# EAGLE design Kube-Module-ADIO (EAGLE 9.6.2)
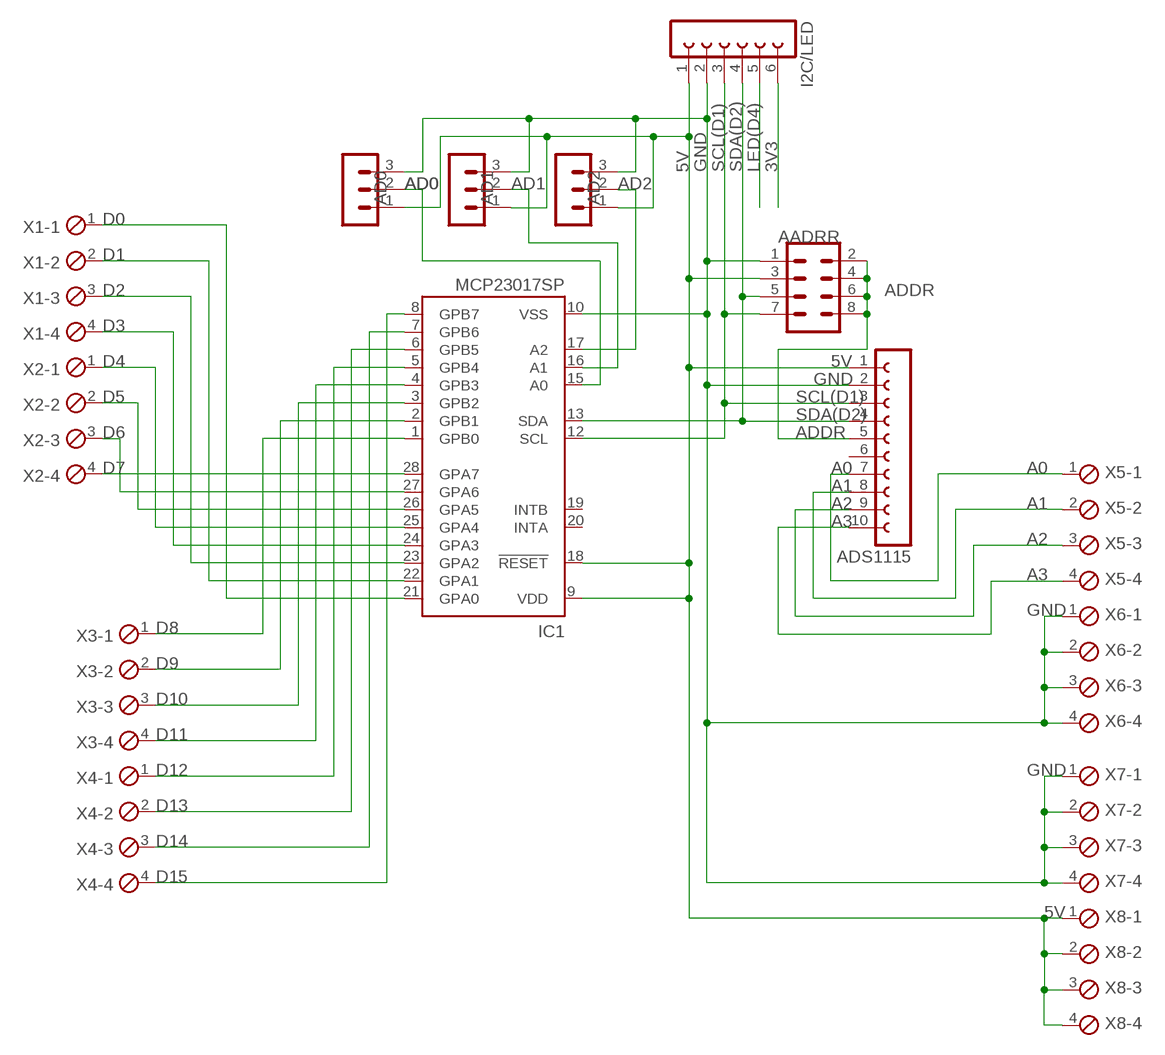
[diagram p0: schematic, sheet 1]

## Parts
AADRR  MA04-2  [MA04-2]
AD0  MA03-1  [MA03-1]
AD1  MA03-1  [MA03-1]
AD2  MA03-1  [MA03-1]
ADS1115  FE10W  [FE10W]
I2C/LED  FE06-1  [FE06]
IC1  MCP23017SP  [DIL28-3]
X1  MPT4  [4POL254]
X2  MPT4  [4POL254]
X3  MPT4  [4POL254]
X4  MPT4  [4POL254]
X5  MPT4  [4POL254]
X6  MPT4  [4POL254]
X7  MPT4  [4POL254]
X8  MPT4  [4POL254]

## Nets
3V3: I2C/LED.6
5V: AADRR.3 AD0.1 AD1.1 AD2.1 ADS1115.1 I2C/LED.1 IC1.9(VDD) IC1.18(!RESET) X8.1 X8.2 X8.3 X8.4
A0: ADS1115.7 X5.1
A1: ADS1115.8 X5.2
A2: ADS1115.9 X5.3
A3: ADS1115.10 X5.4
AD0: AD0.2 IC1.15(A0)
AD1: AD1.2 IC1.16(A1)
AD2: AD2.2 IC1.17(A2)
ADDR: AADRR.2 AADRR.4 AADRR.6 AADRR.8 ADS1115.5
D0: IC1.21(GPA0) X1.1
D1: IC1.22(GPA1) X1.2
D2: IC1.23(GPA2) X1.3
D3: IC1.24(GPA3) X1.4
D4: IC1.25(GPA4) X2.1
D5: IC1.26(GPA5) X2.2
D6: IC1.27(GPA6) X2.3
D7: IC1.28(GPA7) X2.4
D8: IC1.1(GPB0) X3.1
D9: IC1.2(GPB1) X3.2
D10: IC1.3(GPB2) X3.3
D11: IC1.4(GPB3) X3.4
D12: IC1.5(GPB4) X4.1
D13: IC1.6(GPB5) X4.2
D14: IC1.7(GPB6) X4.3
D15: IC1.8(GPB7) X4.4
GND: AADRR.1 AD0.3 AD1.3 AD2.3 ADS1115.2 I2C/LED.2 IC1.10(VSS) X6.1 X6.2 X6.3 X6.4 X7.1 X7.2 X7.3 X7.4
LED(D4): I2C/LED.5
SCL(D1): AADRR.7 ADS1115.3 I2C/LED.3 IC1.12(SCL)
SDA(D2): AADRR.5 ADS1115.4 I2C/LED.4 IC1.13(SDA)
Unconnected: ADS1115.6 IC1.19(INTB) IC1.20(INTA)

## Library data of the parts
AADRR = con-lstb:MA04-2: PIN HEADER; OC_FARNELL: unknown; OC_NEWARK: unknown
AD0 AD1 AD2 = con-lstb:MA03-1: PIN HEADER; OC_FARNELL: unknown; OC_NEWARK: unknown
ADS1115 = con-lsta:FE10W: FEMALE HEADER; OC_FARNELL: unknown; OC_NEWARK: unknown
I2C/LED = con-lsta:FE06-1: FEMALE HEADER; OC_FARNELL: unknown; OC_NEWARK: unknown
IC1 = adafruit:MCP23017: http://ww1.microchip.com/downloads/en/DeviceDoc/21952a.pdf Source: http://ww1.microchip.com/downloads/en/DeviceDoc/21952a.pdf
X1-X8 = con-phoenix-254:MPT4: PHOENIX CONNECTOR; OC_FARNELL: unknown; OC_NEWARK: unknown

## Board
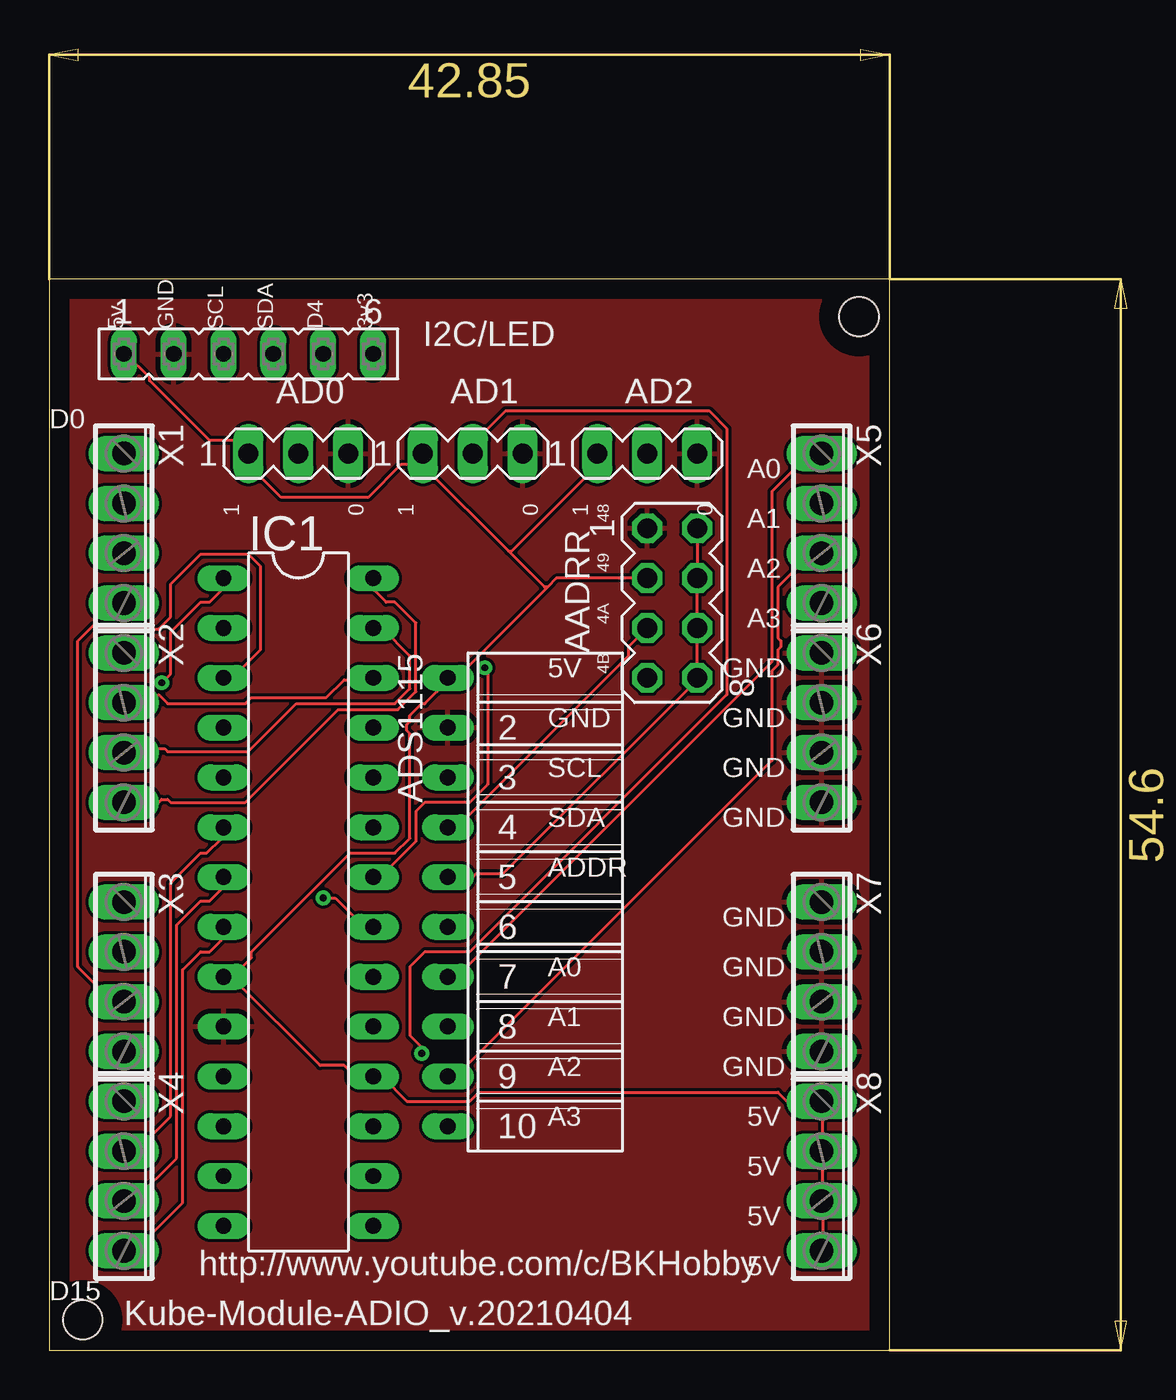
[diagram p1: board, top side]
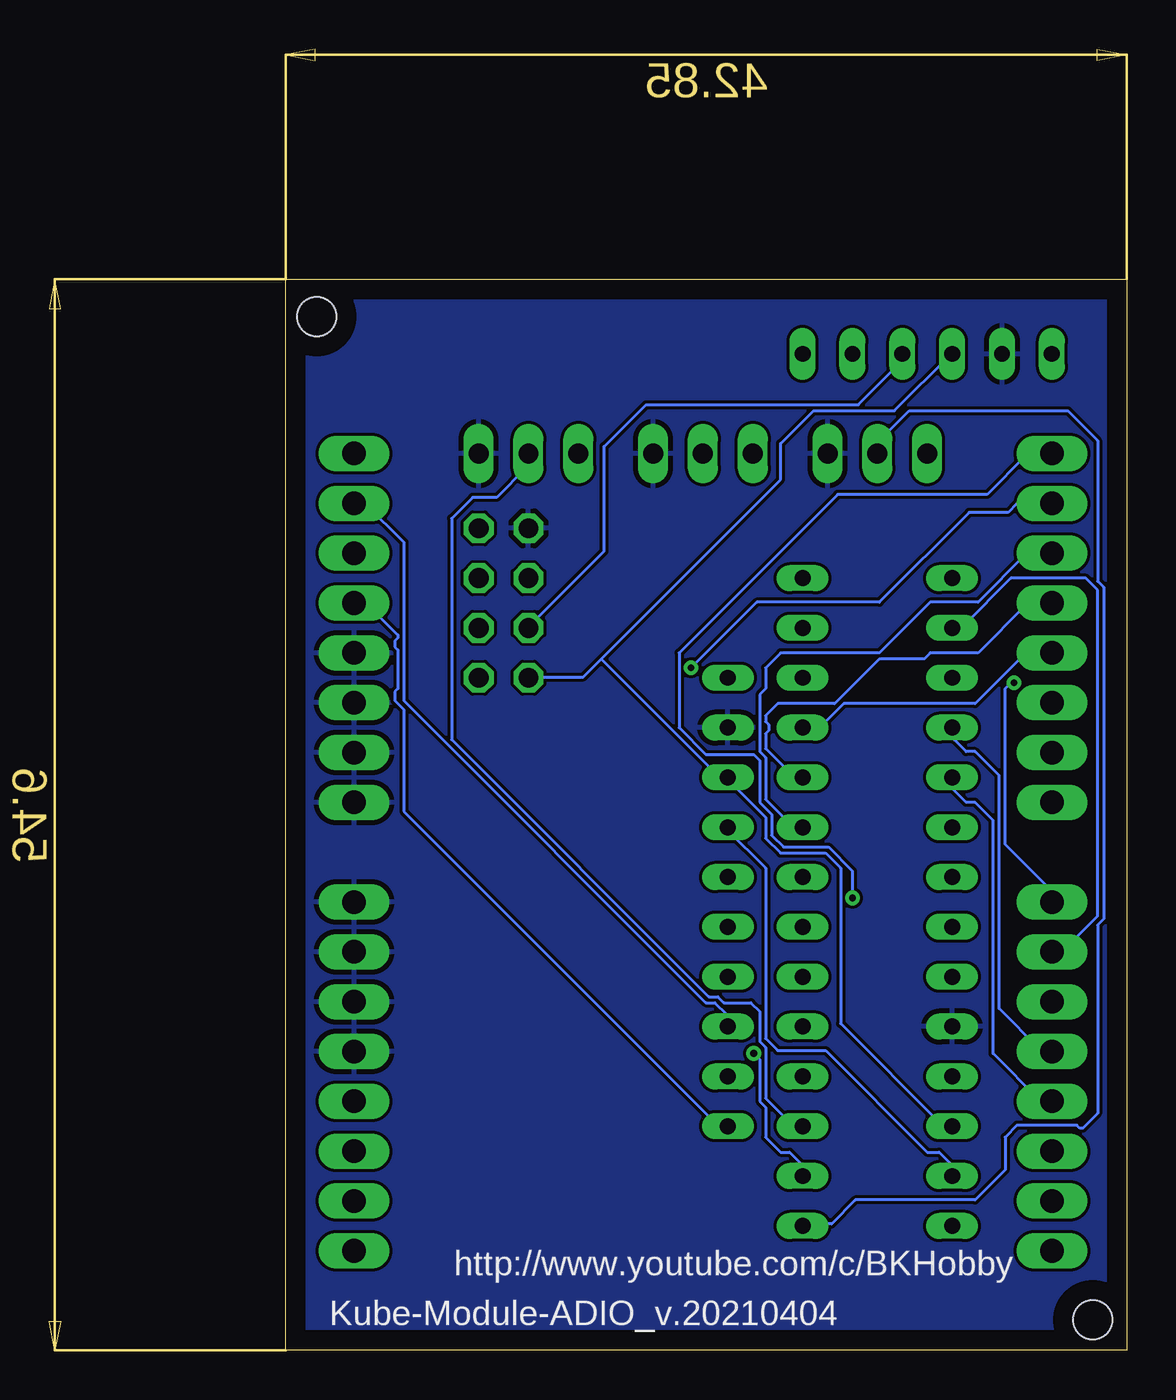
[diagram p2: board, bottom side, seen from below]

Size 42.85 x 54.6 mm. Coordinates in mm from the lower left corner, seen from the top.
Outline: 0,0 42.85,0 42.85,54.6 0,54.6 0,0
Copper layers (1*16): Top 0.035mm / dielectric 1.5mm / Bottom 0.035mm
Design rules "default": minimum track width 6mil, minimum drill 0.35mm, track to track 6mil, track to pad 6mil, pad to pad 6mil, via to via 6mil, smd to smd 6mil, copper to edge 40mil, drill to drill 6mil, minimum pad ring 10mil, minimum via ring 8mil, stop-mask expansion 4mil, vias tented up to drill 0mil, thermal gap 10mil
Holes 2 mm at 41.27,52.7 1.72,1.56

### Footprints (pad centres in the part's own frame; a part is rotated, then mirrored left to right if it is on the bottom)
MA04-2 = drill 1.016 octagon: 1 -3.81,-1.27; 2 -3.81,1.27; 3 -1.27,-1.27; 4 -1.27,1.27; 5 1.27,-1.27; 6 1.27,1.27; 7 3.81,-1.27; 8 3.81,1.27
MA03-1 = drill 1.016 long: 1 -2.54,0; 2 0,0; 3 2.54,0
FE10W = drill 0.813 long: 1 -11.43,0; 2 -8.89,0; 3 -6.35,0; 4 -3.81,0; 5 -1.27,0; 6 1.27,0; 7 3.81,0; 8 6.35,0; 9 8.89,0; 10 11.43,0
FE06 = drill 0.813 long: 1 -6.35,0; 2 -3.81,0; 3 -1.27,0; 4 1.27,0; 5 3.81,0; 6 6.35,0
DIL28-3 = drill 0.813 long: 1 -16.51,-3.81; 2 -13.97,-3.81; 3 -11.43,-3.81; 4 -8.89,-3.81; 5 -6.35,-3.81; 6 -3.81,-3.81; 7 -1.27,-3.81; 8 1.27,-3.81; 9 3.81,-3.81; 10 6.35,-3.81; 11 8.89,-3.81; 12 11.43,-3.81; 13 13.97,-3.81; 14 16.51,-3.81; 15 16.51,3.81; 16 13.97,3.81; 17 11.43,3.81; 18 8.89,3.81; 19 6.35,3.81; 20 3.81,3.81; 21 1.27,3.81; 22 -1.27,3.81; 23 -3.81,3.81; 24 -6.35,3.81; 25 -8.89,3.81; 26 -11.43,3.81; 27 -13.97,3.81; 28 -16.51,3.81
4POL254 = drill 1.2 long: 1 -3.81,0; 2 -1.27,0; 3 1.27,0; 4 3.81,0

### Placement (x,y rotation side)
AADRR  31.75,38.1 270 top
AD0  12.7,45.72 0 top
AD1  21.59,45.72 0 top
AD2  30.48,45.72 0 top
ADS1115  20.32,22.86 270 top
I2C/LED  10.16,50.8 0 top
IC1  12.7,22.86 270 top
X1  3.81,41.91 270 top
X2  3.81,31.75 270 top
X3  3.81,19.05 270 top
X4  3.81,8.89 270 top
X5  39.37,41.91 270 top
X6  39.37,31.75 270 top
X7  39.37,19.05 270 top
X8  39.37,8.89 270 top

### Tracks (layer width: path | path; a pad name or v marks a point on that pad's centre or on a via)
5V
  Top 0.152: I2C/LED.1 3.91,50.8 5.13,49.58 5.13,49.43 8.18,46.38 9.55,46.38 10.16,45.77 AD0.1 10.16,45.16 11.84,43.48 16.26,43.48 17.93,45.16 19.15,45.16 | 25.4,38.91 25.86,39.37 AADRR.3 | 25.4,38.91 20.83,34.34 20.37,34.34 ADS1115.1 19.76,33.73 19.76,33.58 19.15,32.97 19,32.97 18.39,32.36 18.39,32.06 18.24,31.9 18.24,31.6 18.39,31.44 18.39,26.11 17.63,25.35 15.34,25.35 10.31,20.32 10.31,20.02 9.25,18.95 | 19.15,45.16 19.15,45.01 23.42,40.74 | 19.15,45.16 19.15,45.62 AD1.1 19.15,45.16 | 23.42,40.74 25.25,38.91 25.4,38.91 | 23.42,40.74 23.57,40.74 27.84,45.01 27.84,45.62 AD2.1 | X8.4 39.42,5.08 39.42,7.52 X8.3 39.42,7.67 39.42,10.11 X8.2 39.42,10.26 39.42,12.7 X8.1 37.59,12.7 37.14,13.16 21.89,13.16 21.44,12.7 18.24,12.7 17.02,13.92 16.56,13.92 IC1.18 16.41,14.07 15.49,14.07 15.04,14.53 13.82,14.53 9.4,18.95 9.25,18.95 | 9.25,18.95 8.94,18.95 IC1.9 9.25,18.95
A0
  Top 0.152: ADS1115.7 20.37,19.1 20.83,19.1 36.83,35.1 36.83,43.79 38.66,45.62 39.27,45.62 X5.1
A1
  Bottom 0.152: X5.2 38.81,43.18 36.83,41.2 36.83,33.12 21.44,17.73 20.98,17.73 20.37,17.12 20.37,16.51 ADS1115.8
A2
  Top 0.152: ADS1115.9 20.37,14.07 20.83,14.07 36.83,30.07 36.83,34.65 37.14,34.95 37.14,35.71 37.29,35.86 37.29,36.17 37.14,36.32 37.14,38.91 38.81,40.59 39.27,40.59 X5.3
A3
  Bottom 0.152: ADS1115.10 20.37,11.48 20.83,11.48 36.83,27.48 36.83,32.66 37.29,33.12 37.29,33.58 37.14,33.73 37.14,35.71 37.29,35.86 37.29,36.17 37.14,36.32 37.14,36.47 38.66,38 39.27,38 X5.4
AD0
  Bottom 0.152: IC1.15 16.41,6.45 15.04,6.45 13.82,7.67 7.72,7.67 6.2,9.2 6.2,10.87 5.59,11.48 2.54,11.48 2.39,11.33 2.23,11.33 1.47,12.09 1.47,21.69 1.17,22 1.17,38.91 1.47,39.22 1.47,46.38 3,47.9 11.07,47.9 12.6,46.38 12.6,45.77 AD0.2
AD1  (via drill 0.35)
  Top 0.152: v19,15.14 19,15.44 18.39,16.05 18.39,19.56 19.15,20.32 21.44,20.32 34.54,33.43 34.54,46.99 33.63,47.9 23.27,47.9 21.59,46.23 AD1.2
  Bottom 0.152: v19,15.14 18.69,14.83 18.69,12.7 18.39,12.39 18.39,10.87 17.63,10.11 17.17,10.11 16.56,9.5 16.56,8.89 IC1.16
AD2
  Bottom 0.152: IC1.17 16.56,11.48 17.02,11.48 18.39,12.85 18.39,15.44 18.69,15.75 18.69,17.27 19.15,17.73 20.52,17.73 20.83,18.03 21.29,18.03 34.39,31.14 34.39,42.42 33.33,43.48 32.11,43.48 30.58,45.01 30.58,45.62 AD2.2
ADDR
  Top 0.152: AADRR.2 AADRR.4 AADRR.6 AADRR.8 33.02,34.19 23.11,24.28 21.74,24.28 21.59,24.13 ADS1115.5
D0  (via drill 0.35)
  Top 0.152: v13.97,23.06 14.58,23.06 15.95,21.69 16.41,21.69 IC1.21
  Bottom 0.152: v13.97,23.06 13.97,24.43 15.19,25.65 17.47,25.65 18.08,26.26 18.08,27.33 18.69,27.94 18.69,30.07 19,30.38 21.44,30.38 22.81,31.75 22.81,35.56 14.73,43.64 7.11,43.64 5.13,45.62 3.91,45.62 X1.1
D1  (via drill 0.35)
  Top 0.152: IC1.22 16.87,24.13 18.69,25.96 18.69,27.48 19.15,27.94 21.44,27.94 22.35,28.85 22.35,34.65 v22.2,34.8
  Bottom 0.152: v22.2,34.8 18.85,38.15 12.6,38.15 8.03,42.72 6.04,42.72 5.59,43.18 X1.2
D2
  Bottom 0.152: IC1.23 16.56,26.72 17.02,26.72 18.39,28.09 18.39,30.23 18.69,30.53 18.69,33.43 18.39,33.73 18.39,34.8 17.63,35.56 12.6,35.56 10.01,38.15 7.57,38.15 5.13,40.59 3.91,40.59 X1.3
D3
  Bottom 0.152: IC1.24 16.56,29.31 17.02,29.31 18.39,30.68 18.39,31.44 18.24,31.6 18.24,31.9 18.39,32.06 18.39,32.36 17.78,32.97 14.88,32.97 12.6,35.25 10.31,35.25 10.01,35.56 7.57,35.56 5.13,38 3.91,38 X1.4
D4
  Bottom 0.152: IC1.25 15.65,31.75 14.43,32.97 7.72,32.97 5.13,35.56 X2.1
D5
  Top 0.152: IC1.26 16.41,34.19 15.04,34.19 14.12,33.27 10.31,33.27 10.01,32.97 6.04,32.97 5.59,33.43 5.28,33.12 3.91,33.12 X2.2
D6
  Top 0.152: IC1.27 16.56,36.78 17.02,36.78 18.39,35.41 18.39,33.73 17.63,32.97 12.6,32.97 10.16,30.53 6.04,30.53 5.89,30.68 4.06,30.68 3.91,30.53 X2.3
D7
  Top 0.152: X2.4 5.59,27.94 5.74,28.09 6.04,28.09 6.2,27.94 10.01,27.94 14.73,32.66 17.78,32.66 18.69,33.58 18.69,37.08 17.63,38.15 17.17,38.15 16.56,38.76 16.56,39.37 IC1.28
D8  (via drill 0.35)
  Top 0.152: v5.74,34.04 6.2,34.49 6.2,36.63 7.72,38.15 8.18,38.15 8.79,38.76 8.79,39.37 IC1.1
  Bottom 0.152: v5.74,34.04 5.89,34.04 6.2,33.73 6.2,25.81 3.91,23.52 3.91,22.91 X3.1
D9
  Bottom 0.152: X3.2 3.3,20.32 1.47,22.15 1.47,38.76 2.08,39.37 5.89,39.37 8.33,36.93 8.79,36.93 IC1.2
D10
  Top 0.152: IC1.3 8.94,34.34 9.4,34.34 10.77,35.71 10.77,39.98 10.16,40.59 7.72,40.59 6.2,39.06 6.2,37.39 5.59,36.78 2.54,36.78 2.39,36.93 2.23,36.93 1.47,36.17 1.47,19.56 3.15,17.88 3.76,17.88 X3.3
D11
  Bottom 0.152: IC1.4 8.79,31.75 8.79,31.14 8.18,30.53 7.72,30.53 6.5,29.31 6.5,17.42 4.37,15.29 3.91,15.29 X3.4
D12
  Bottom 0.152: X4.1 4.37,12.7 6.81,15.14 6.81,27.03 7.72,27.94 8.18,27.94 8.79,28.55 8.79,29.16 IC1.5
D13
  Top 0.152: IC1.6 8.79,26.57 8.79,26.11 8.03,25.35 7.72,25.35 6.2,23.82 6.2,11.94 4.52,10.26 3.91,10.26 X4.2
D14
  Top 0.152: IC1.7 8.79,24.13 8.79,23.52 8.18,22.91 7.72,22.91 6.5,21.69 6.5,9.8 4.37,7.67 3.91,7.67 X4.3
D15
  Top 0.152: X4.4 4.37,5.08 6.81,7.52 6.81,19.41 7.72,20.32 8.18,20.32 8.79,20.93 8.79,21.54 IC1.8
GND
  pour Top: 0,54.61 43.18,54.61 43.18,0 0,0
  pour Bottom: 0,54.61 43.18,54.61 43.18,0 0,0
SCL(D1)
  Bottom 0.152: IC1.12 8.94,11.48 9.4,11.48 14.58,16.66 14.58,24.59 15.34,25.35 17.63,25.35 18.39,26.11 18.39,27.18 20.37,29.16 ADS1115.3 20.37,29.31 20.83,29.31 26.77,35.25 | 26.77,35.25 27.69,34.34 30.43,34.34 AADRR.7 | 26.77,35.25 17.63,44.4 17.63,46.23 15.95,47.9 11.84,47.9 8.94,50.8 I2C/LED.3
SDA(D2)
  Top 0.152: AADRR.5 29.51,35.86 29.51,35.41 20.83,26.72 20.37,26.72 ADS1115.4
  Bottom 0.152: IC1.13 8.94,8.89 8.94,9.5 9.55,10.11 10.16,10.11 15.34,15.29 17.78,15.29 18.39,15.9 18.39,24.59 20.37,26.57 ADS1115.4 | I2C/LED.4 11.53,50.8 11.53,50.34 13.66,48.21 24.49,48.21 26.62,46.08 26.62,40.74 30.43,36.93 AADRR.5

### Text on the board
tNames: 5v | GND | SCL | SDA | D4 | 3v3 | D0 | A0 | 1 | 0 | 1 | 0 | 1 | 48 | 0 | A1 | 49 | A2 | 4A | A3 | 4B | 5V | GND | GND | GND | SCL | GND | SDA | GND | ADDR | GND | A0 | GND | A1 | GND | A2 | GND | A3 | 5V | 5V | 5V | http://www.youtube.com/c/BKHobby | 5V | D15 | Kube-Module-ADIO_v.20210404
bNames: http://www.youtube.com/c/BKHobby | Kube-Module-ADIO_v.20210404